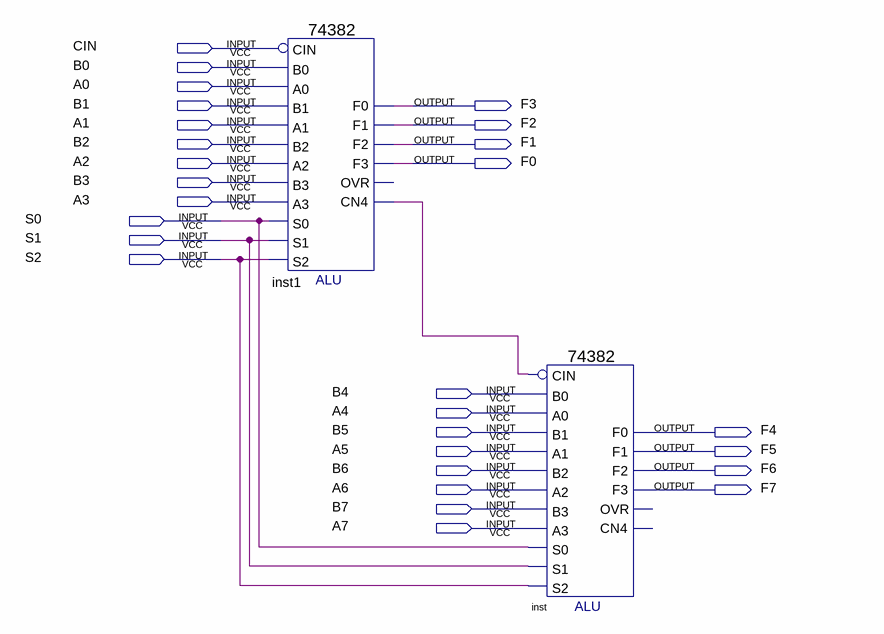
[diagram p0: schematic sheet]
// Quartus schematic ula1.bdf as structural Verilog: 2 symbols, 28 pins
module ula1 (
  input  CIN,
  input  B0,
  input  A0,
  input  B1,
  input  A1,
  input  B2,
  input  A2,
  input  B3,
  input  A3,
  input  S0,
  input  S1,
  input  S2,
  input  B4,
  input  A4,
  input  B5,
  input  A5,
  input  B6,
  input  A6,
  input  B7,
  input  A7,
  output F3,
  output F2,
  output F1,
  output F0,
  output F4,
  output F5,
  output F6,
  output F7
);

  wire inst1_cn4;

  \74382  inst1 (
    .B3(B3), .A3(A3), .B0(B0), .A0(A0), .B1(B1), .S2(S2), .S1(S1), .S0(S0), .A1(A1), .B2(B2), .A2(A2),
    .CIN(CIN), .F1(F2), .F0(F3), .CN4(inst1_cn4), .F3(F0), .F2(F1));  // open: OVR
  \74382  inst (
    .B3(B7), .A3(A7), .B0(B4), .A0(A4), .B1(B5), .S2(S2), .S1(S1), .S0(S0), .A1(A5), .B2(B6), .A2(A6),
    .CIN(inst1_cn4), .F1(F5), .F0(F4), .F3(F7), .F2(F6));  // open: CN4, OVR
endmodule
